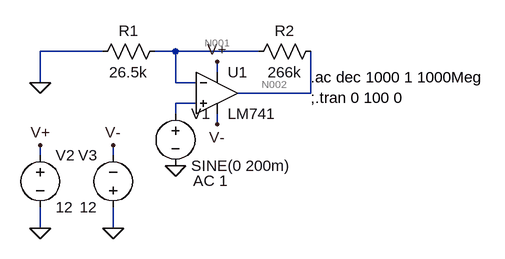
[diagram p0: schematic Amplificatore_non_invertente.asc]
Amplificatore_non_invertente.asc, the LTspice schematic file:
Version 4.1
SHEET 1 880 680
WIRE 128 96 32 96
WIRE 240 96 208 96
WIRE 368 96 240 96
WIRE 304 128 304 112
WIRE 32 144 32 96
WIRE 240 144 240 96
WIRE 272 144 240 144
WIRE 448 160 448 96
WIRE 448 160 336 160
WIRE 272 176 240 176
WIRE 240 192 240 176
WIRE 304 208 304 192
WIRE 32 256 32 240
WIRE 144 256 144 240
WIRE 32 368 32 336
WIRE 144 368 144 336
FLAG 32 144 0
FLAG 304 112 V+
FLAG 304 208 V-
FLAG 32 240 V+
FLAG 240 272 0
FLAG 32 368 0
FLAG 144 240 V-
FLAG 144 368 0
SYMBOL OpAmps\\LM741 304 96 R0
SYMATTR InstName U1
SYMBOL voltage 240 176 R0
WINDOW 123 27 119 Left 2
WINDOW 39 0 0 Left 0
SYMATTR Value2 AC 1
SYMATTR InstName V1
SYMATTR Value SINE(0 200m)
SYMBOL res 224 80 R90
WINDOW 0 0 56 VBottom 2
WINDOW 3 32 56 VTop 2
SYMATTR InstName R1
SYMATTR Value 26.5k
SYMBOL res 464 80 R90
WINDOW 0 0 56 VBottom 2
WINDOW 3 32 56 VTop 2
SYMATTR InstName R2
SYMATTR Value 266k
SYMBOL voltage 32 240 R0
WINDOW 123 0 0 Left 0
WINDOW 39 0 0 Left 0
SYMATTR InstName V2
SYMATTR Value 12
SYMBOL voltage 144 352 R180
WINDOW 0 24 96 Left 2
WINDOW 3 24 16 Left 2
WINDOW 123 0 0 Left 0
WINDOW 39 0 0 Left 0
SYMATTR InstName V3
SYMATTR Value 12
TEXT 448 136 Left 2 !.ac dec 1000 1 1000Meg\n;.tran 0 100 0

The netlist it stands for:
* Amplificatore_non_invertente.asc
X§U1 N003 N001 V+ V- N002 LM741  ; pins In+ In- V+ V- OUT
V1 N003 0 SINE(0 200m) AC 1
R1 N001 0 26.5k
R2 N002 N001 266k
V2 V+ 0 12
V3 0 V- 12
.ac dec 1000 1 1000Meg
;.tran 0 100 0
.lib LM741.lib
.backanno
.end

* Results of the author's LTspice run, read from the files saved beside the schematic
* Operating Point, zero values left out:
*   V(n001) = 999.8 µV
*   V(v-) = -12 V
*   V(n002) = 38.13 mV
*   V(v+) = 12 V
*   I(V1) = -57.86 nA
*   I(V2) = -1.626 mA
*   I(R2) = 139.6 nA
*   I(R1) = 37.73 nA
*   I(V3) = -1.626 mA
*   Ix(u1:1) = 57.86 nA
*   Ix(u1:2) = 101.9 nA
*   Ix(u1:99) = 1.626 mA
*   Ix(u1:50) = -1.626 mA
*   Ix(u1:28) = -139.6 nA
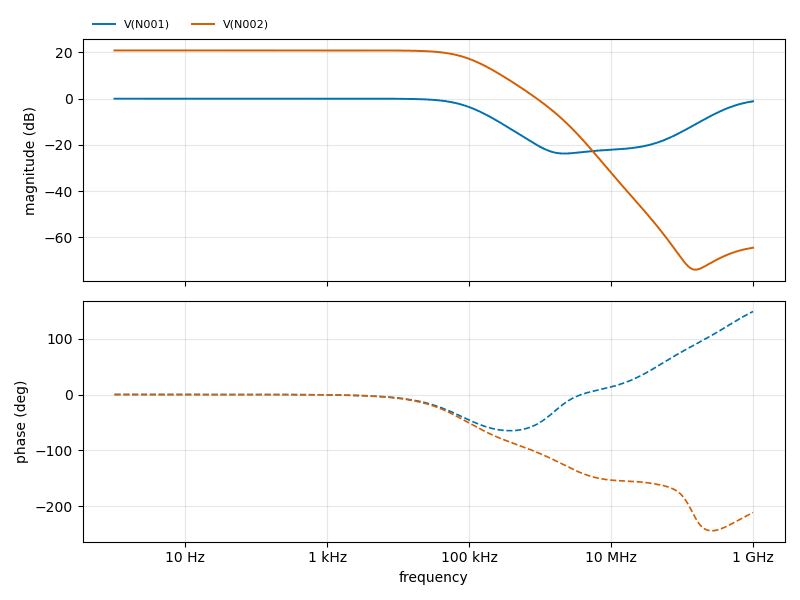
[diagram p1: AC Analysis of Amplificatore_non_invertente.asc, plotted from the saved traces]
* AC Analysis, 1 run:
*   V(N001): -0.00 dB at 1 Hz, -1.15 dB at 1 GHz, peak -0.00 dB at 1 Hz, 3 dB below the peak at 87.03 kHz
*   V(N002): 20.86 dB at 1 Hz, -64.45 dB at 1 GHz, peak 20.86 dB at 1 Hz, 3 dB below the peak at 86.94 kHz